# Altium schematic sheet SWIR-LED-Board-SCH_SH2_(01).SchDoc: SCHEMATIC
size 863 x 558 mm; DocumentNumber: XXX-20XXX-XXX; SheetNumber: 2; SheetTotal: 2; PageSetup: Record=PageOptions|CenterHorizontal=True|CenterVertical=True|PrintScale=0.98|XCorrection=1.00|YCorrection=1.00|PrintKind=2|BorderSize=5000000|LeftOffset=0|BottomOffset=0|Orientation=2|PaperLength=1000|PaperWidth=1000|Scale=100|PaperSource=15|PrintQuality=1200|MediaType=1|DitherType=10|PaperKind=11 x 17|PrintScaleMode=1
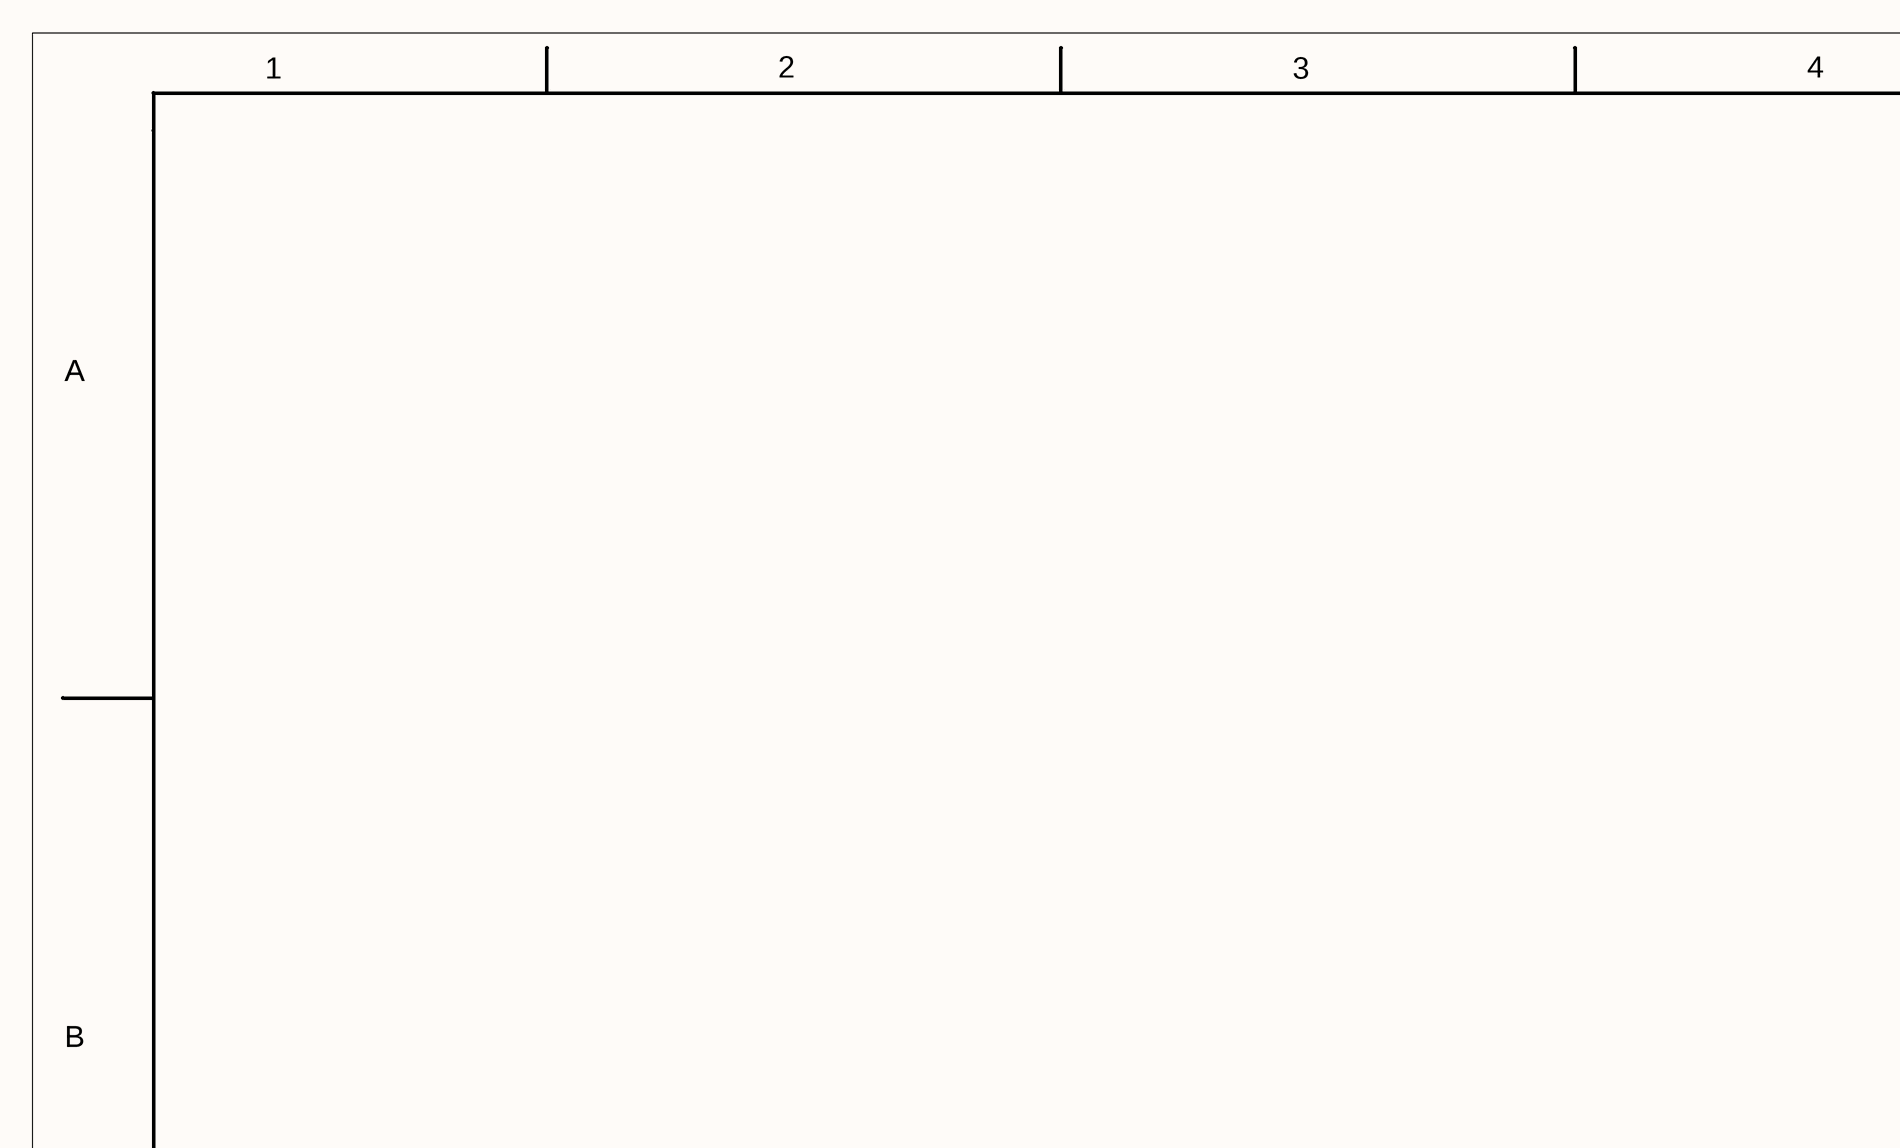
[diagram p0: SWIR-LED-Board-SCH_SH2_(01).SchDoc, top left]
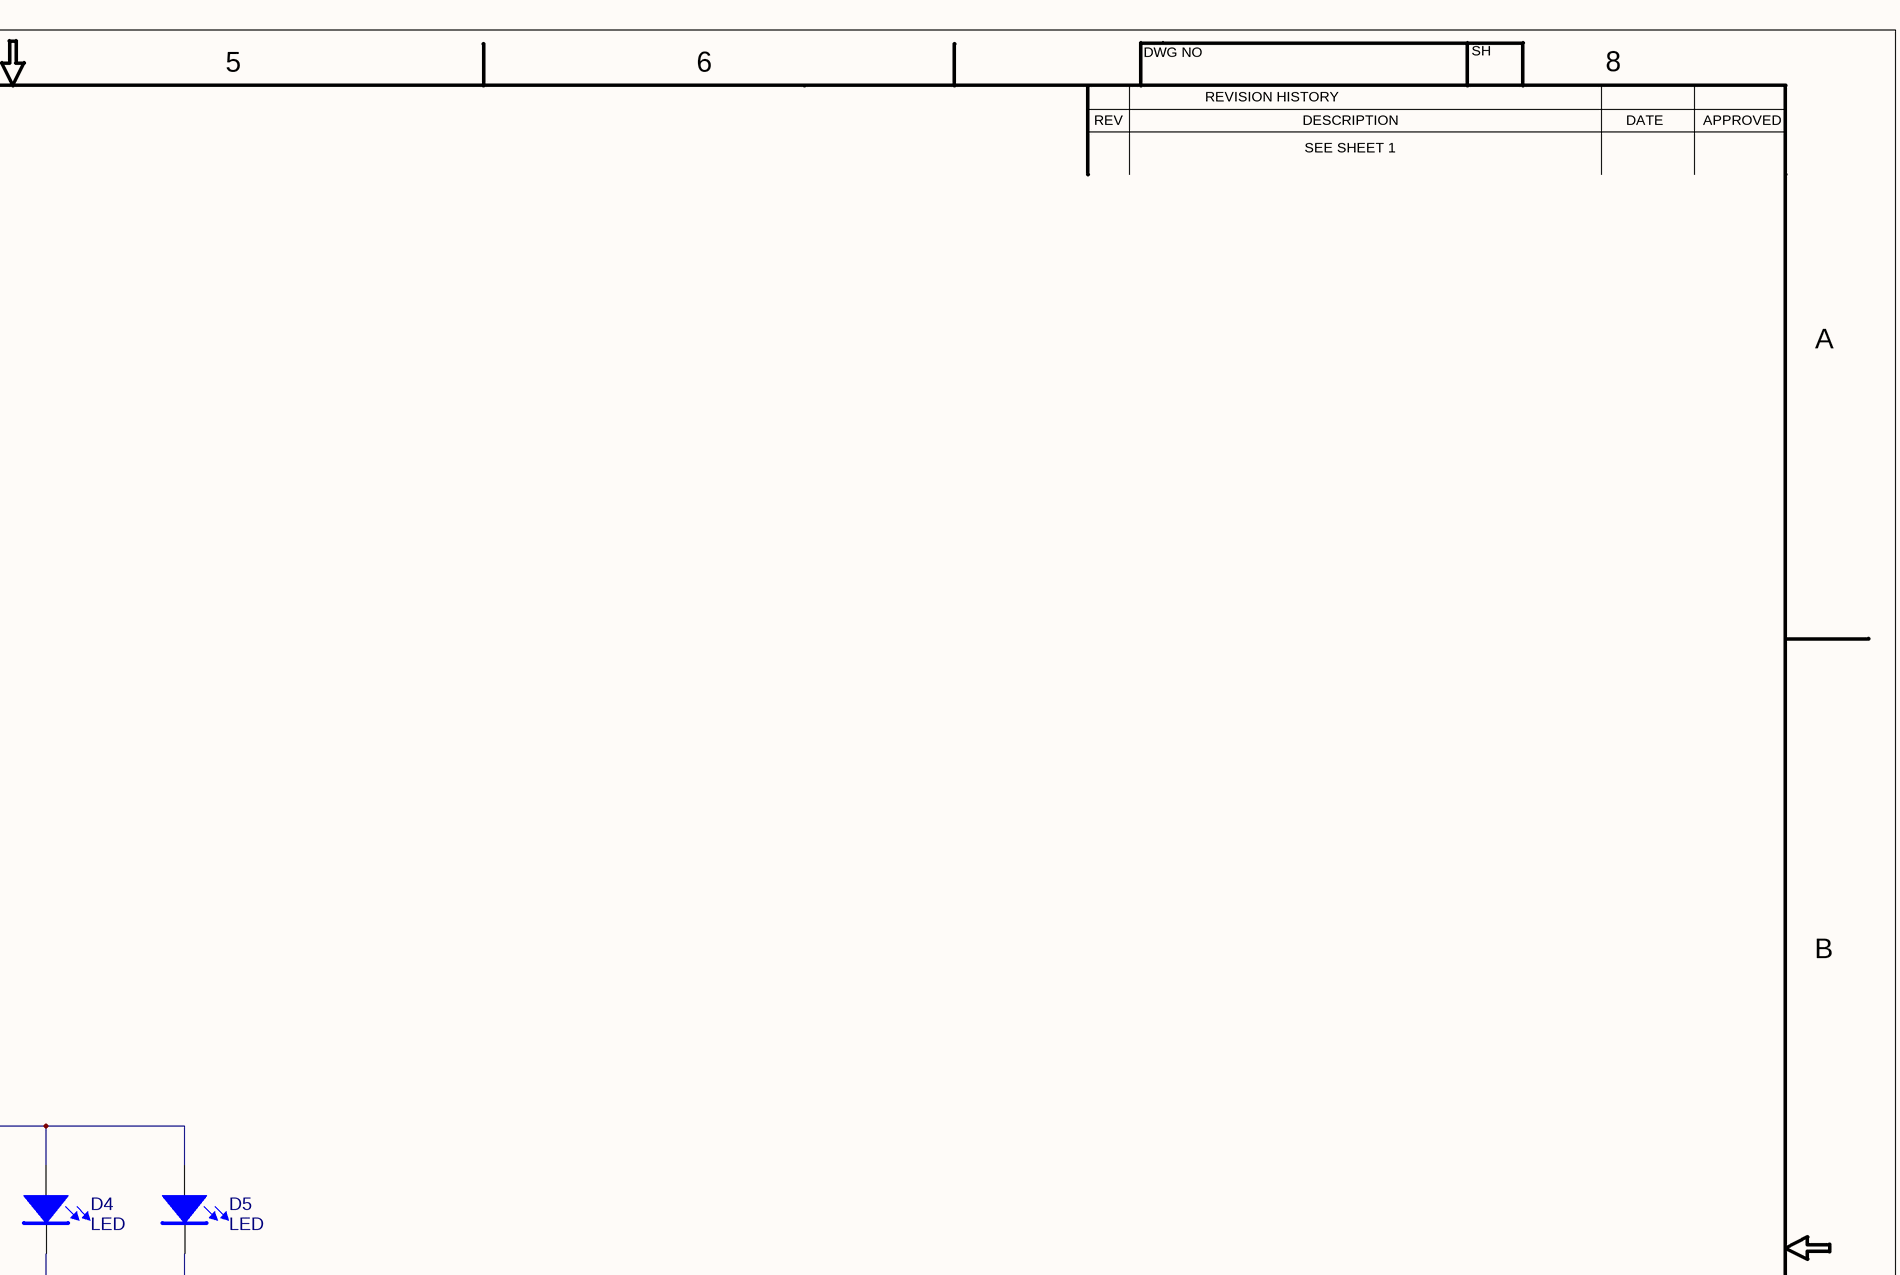
[diagram p1: SWIR-LED-Board-SCH_SH2_(01).SchDoc, top right]
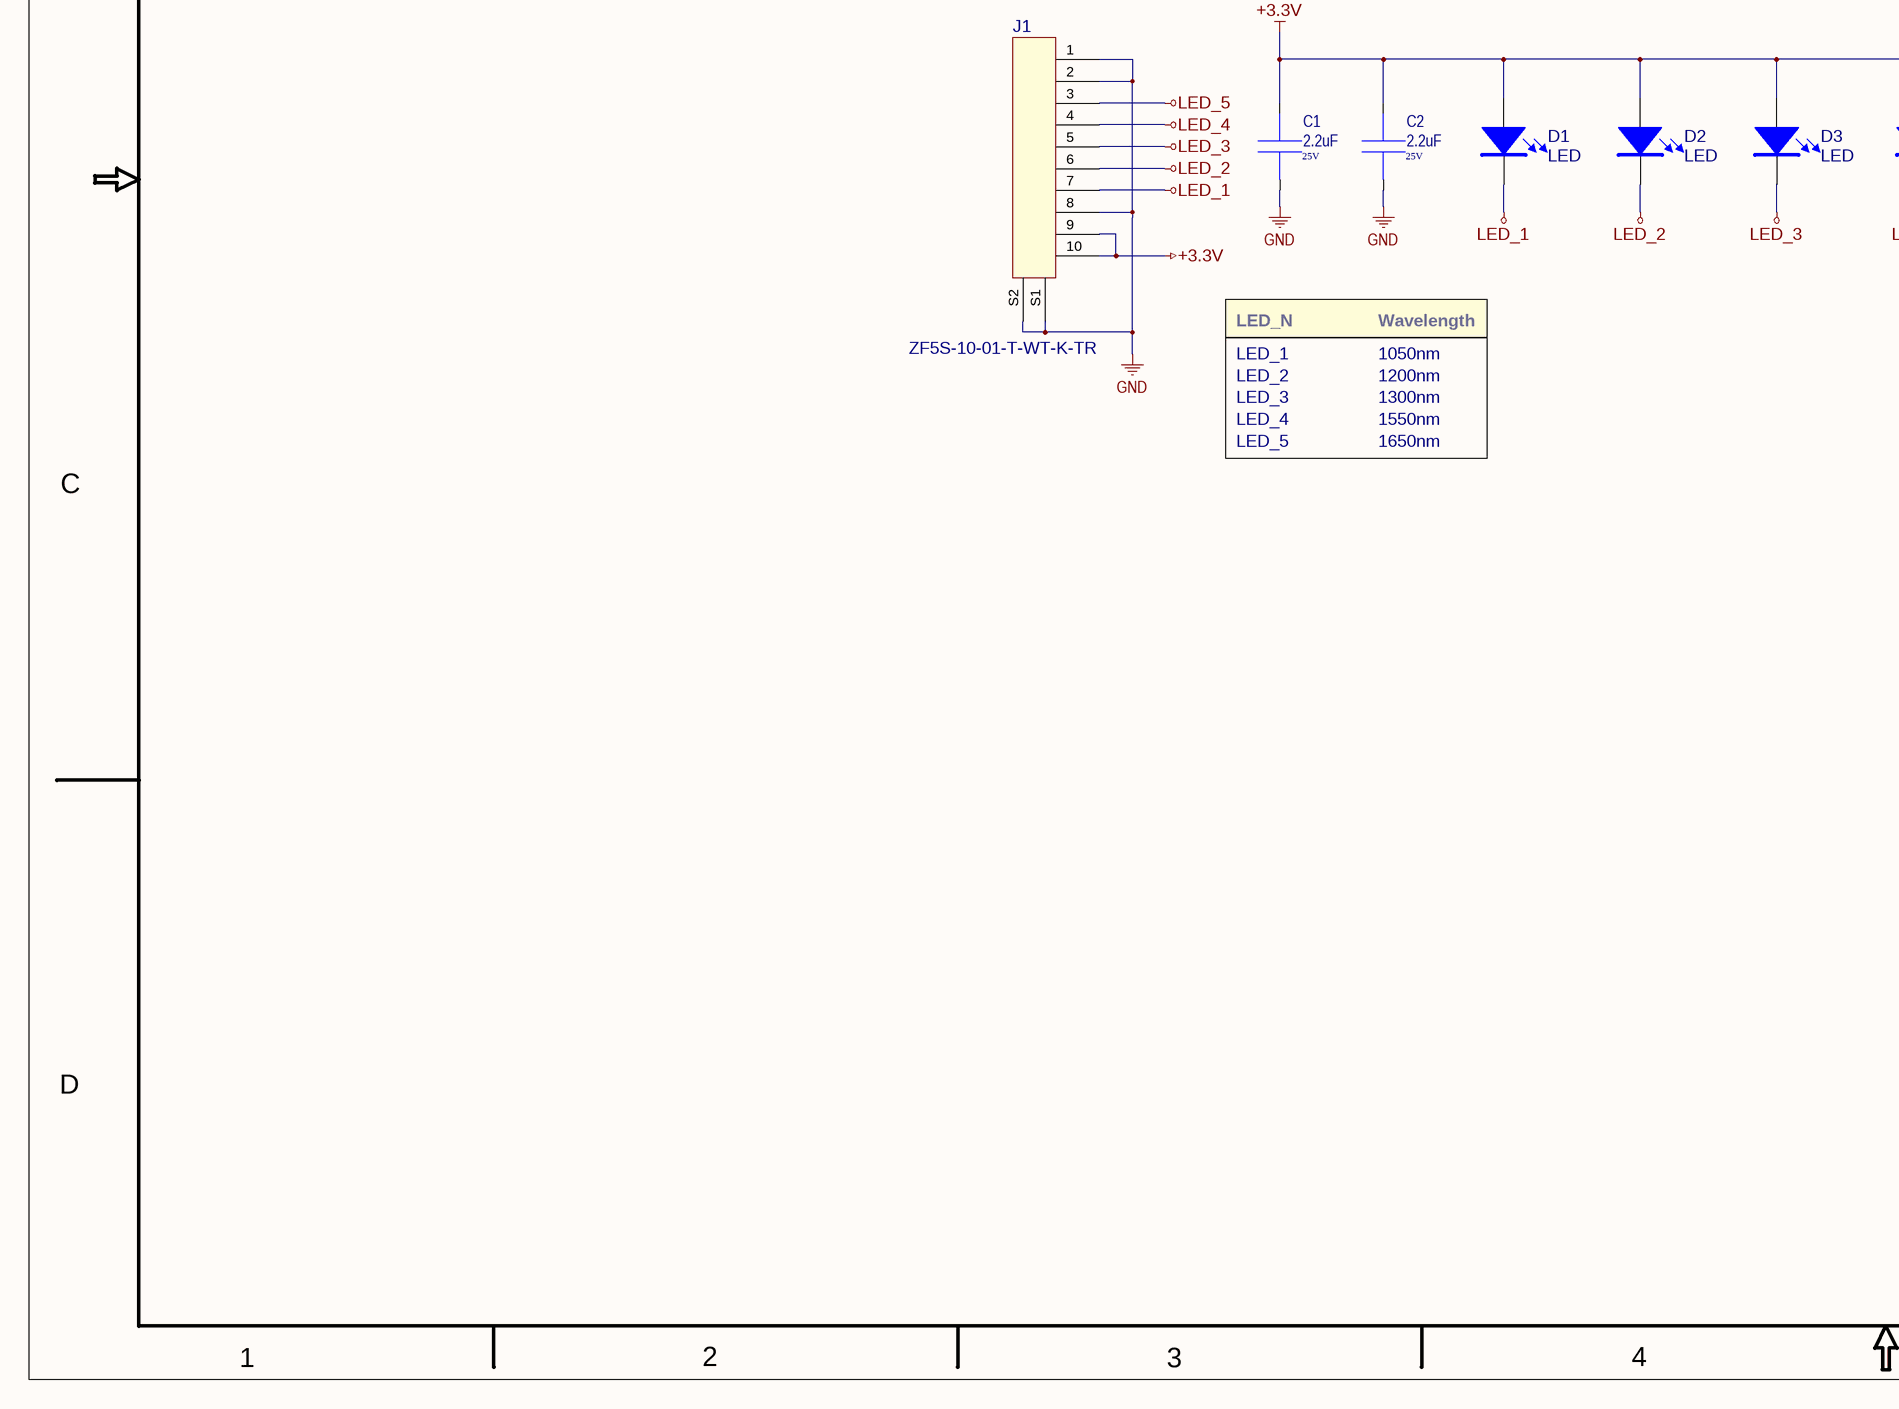
[diagram p2: SWIR-LED-Board-SCH_SH2_(01).SchDoc, bottom left]
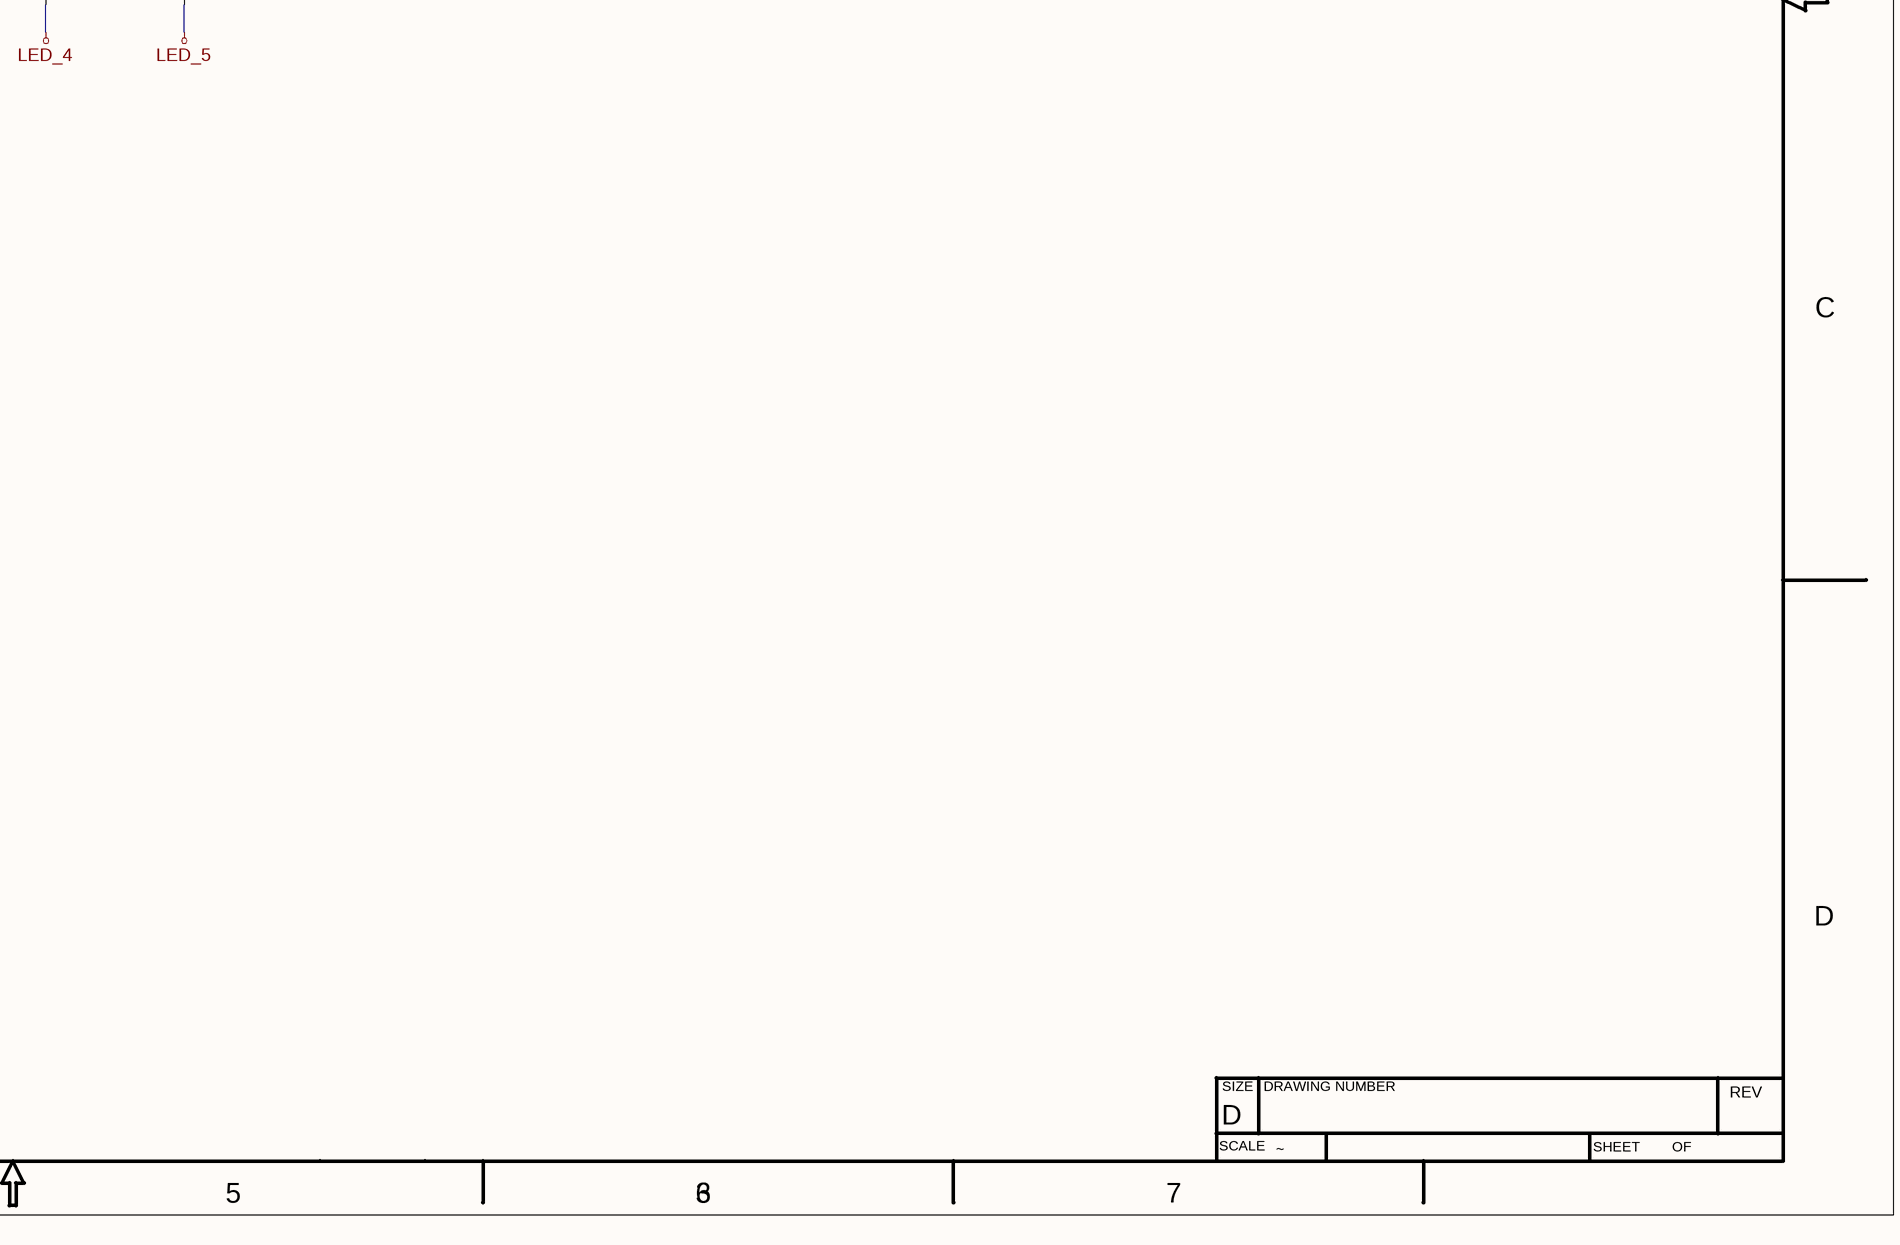
[diagram p3: SWIR-LED-Board-SCH_SH2_(01).SchDoc, bottom right]

## Parts
C1  2.2uF  Voltage: 25V  [0805]
C2  2.2uF  Voltage: 25V  [0805]
D1  LED  [1206_LED]
D2  LED  [1206_LED]
D3  LED  [1206_LED]
D4  LED  [1206_LED]
D5  LED  [1206_LED]
J1  ZF5S-10-01-T-WT-K-TR  [ZF5S-10-01-T-WT-K-TR]

## Nets
+3.3V: C1.2 C2.2 D1.1(A) D2.1(A) D3.1(A) D4.1(A) D5.1(A) J1.9 J1.10
GND: C1.1 C2.1 J1.1 J1.2 J1.8 J1.S1 J1.S2
LED_1: D1.2(K) J1.7
LED_2: D2.2(K) J1.6
LED_3: D3.2(K) J1.5
LED_4: D4.2(K) J1.4
LED_5: D5.2(K) J1.3

## Notes on the sheet
- 1
- 2
- 3
- 4
- 5
- 6
- DWG NO
- REVISION HISTORY
- SH
- 8
- REV
- DESCRIPTION
- SEE SHEET 1
- DATE
- APPROVED
- A
- B
- LED_1
- LED_N
- 1050nm
- Wavelength
- LED_2
- LED_3
- 1200nm
- 1300nm
- LED_4
- LED_5
- 1550nm
- 1650nm
- C
- D
- SIZE
- DRAWING NUMBER
- SCALE
- ~
- SHEET        OF
- 7

## Library data of the parts
C1 C2 = CAP: CAP CER 2.2UF 25V X7R 0805; Part Number: C2012X7R1E225M085AB; Manufacturer: TDK
D1-D5 = LED: Manufacturer: Marktech Optoelectronics; Part Number: *
J1 = ZF5S-10-01-T-WT-K-TR: Manufacturer: Samtec; Part Number: ZF5S-10-01-T-WT-K-TR